# Altium project bms_afe_tester-1_1.PrjPcb (part 2 of 2)

## Sheet pmic_mt3406_buck.SchDoc
size A
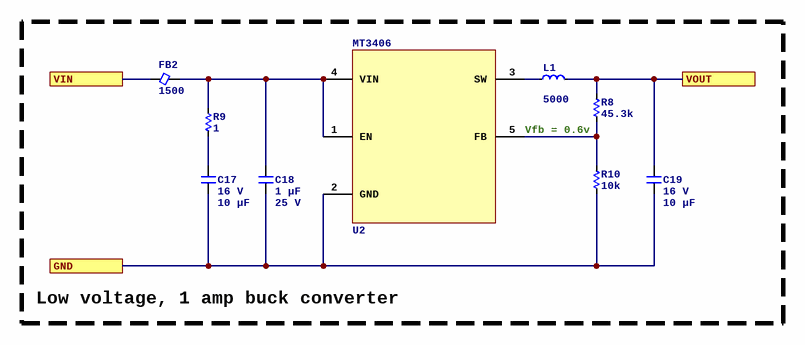
[diagram p10: pmic_mt3406_buck.SchDoc]

### Parts
C17  Voltage Rating: 16 V  Capacitance: 10 µF  [C0805]  (hidden comment: CL21B106KOQNNNE)
C18  Capacitance: 1 µF  Voltage Rating: 25 V  [C0603]  (hidden comment: CL10B105KA8NNNC)
C19  Voltage Rating: 16 V  Capacitance: 10 µF  [C0805]  (hidden comment: CL21B106KOQNNNE)
FB2  Current Rating (mA): 1500  [FB0805]  (hidden comment: MPZ2012S102AT000)
L1  Current Rating (mA): 5000  [SMD-4.1x4.1x2.0]  (hidden comment: FTC404020S4R7MGCA)
R8  value 45.3k  [R0402]  (hidden comment: FRC0402F4532TS)
R9  value 1  [R0402]  (hidden comment: CRCW04021R00FKEDC)
R10  value 10k  [R0402]  (hidden comment: 0402WGF1002TCE)
U2  MT3406  [5SOT23]

### Ports
GND, VIN, VOUT

### Nets
3P3: C19.1 L1.2 R8.1 ; port VOUT
GND: C17.2 C18.2 C19.2 R10.2 U2.2(GND) ; port GND
NetC17_1: C17.1 R9.1
NetC18_1: C18.1 FB2.2 R9.2 U2.1(EN) U2.4(VIN)
NetD2_2: FB2.1 ; port VIN
NetL1_1: L1.1 U2.3(SW)
NetR8_2: R8.2 R10.1 U2.5(FB)

### Notes on the sheet
- Vfb = 0.6v
- Low voltage, 1 amp buck converter

### Library data of the parts
C17 C19 = CL21B106KOQNNNE: Manufacturer: Samsung Electro-Mechanics; Dielectric: X7R; Manufacturer Part Number: CL21B106KOQNNNE; Package: 0805; Supplier 2: LCSC; Supplier Part Number 2: C95841; ComponentLink1Description: Datasheet; ComponentLink1URL: https://wmsc.lcsc.com/wmsc/upload/file/pdf/v2/lcsc/2304140030_Samsung-Electro-Mechanics-CL21B106KOQNNNE_C95841.pdf
C18 = CL10B105KA8NNNC: Manufacturer: Samsung Electro-Mechanics; Dielectric: X7R; ComponentLink1URL: https://wmsc.lcsc.com/wmsc/upload/file/pdf/v2/lcsc/2304140030_Samsung-Electro-Mechanics-CL10B105KA8NNNC_C29936.pdf; ComponentLink1Description: Datasheet; Manufacturer Part Number: CL10B105KA8NNNC; Package: 0603; Supplier 2: LCSC; Supplier Part Number 2: C29936
FB2 = MPZ2012S102AT000: Manufacturer: TDK; Z @ 100 MHz: 1000; DCR (mOhms): 150; Manufacturer Part Number: MPZ2012S102AT000; Package: 0805; Supplier 2: LCSC; Supplier Part Number 2: C76817; ComponentLink1Description: Datasheet; ComponentLink1URL: https://wmsc.lcsc.com/wmsc/upload/file/pdf/v2/lcsc/2304140030_TDK-MPZ2012S102AT000_C76817.pdf
L1 = FTC404020S4R7MGCA: 4.7 µH SMD power inductor; Manufacturer: cjiang; DCR (mOhms): 58; Inductance (µH): 4.7; Manufacturer Part Number: FTC404020S4R7MGCA; ComponentLink1Description: Datasheet; ComponentLink1URL: https://www.lcsc.com/datasheet/C39676072.pdf; Supplier 2: LCSC; Supplier Part Number 2: C39676072
R8 = FRC0402F4532TS: Manufacturer: FOJAN; Tolerance: 1%; Temperature Coefficient: ±100ppm/?; Power Rating (mW): 62.5; ComponentLink1Description: Datasheet; ComponentLink1URL: https://datasheet.lcsc.com/lcsc/2308241947_FOJAN-FRC0402F4532TS_C2933099.pdf; Manufacturer Part Number: FRC0402F4532TS; Package: 0402; Supplier 2: LCSC; Supplier Part Number 2: C2933099
R9 = CRCW04021R00FKEDC: Manufacturer: Vishay Intertech; Tolerance: 1%; Temperature Coefficient: ±100ppm/?; Power Rating (mW): 62.5; ComponentLink1Description: Datasheet; ComponentLink1URL: https://datasheet.lcsc.com/lcsc/2304140030_Vishay-Intertech-CRCW04021R00FKEDC_C2077765.pdf; Manufacturer Part Number: CRCW04021R00FKEDC; Package: 0402; Supplier 2: LCSC; Supplier Part Number 2: C2077765
R10 = 0402WGF1002TCE: Manufacturer: UNI-ROYAL(Uniroyal Elec); Tolerance: 1%; Temperature Coefficient: ±100ppm/?; Power Rating (mW): 62.5; ComponentLink1Description: Datasheet; ComponentLink1URL: https://wmsc.lcsc.com/wmsc/upload/file/pdf/v2/lcsc/2206010100_UNI-ROYAL-Uniroyal-Elec-0402WGF1002TCE_C25744.pdf; Manufacturer Part Number: 0402WGF1002TCE; Package: 0402; Supplier 2: LCSC; Supplier Part Number 2: C25744
U2 = MT3406: 1 A synchronous buck converter, 2–6 V input, 1.5 MHz, 0.6 V minimum output, 10 µA typical quiescent current, SOT-23-5; Manufacturer: XI'AN Aerosemi Tech; Supplier 2: LCSC; Supplier Part Number 2: C22462728; Manufacturer Part Number: MT3406; ComponentLink1Description: Datasheet; ComponentLink1URL: https://www.lcsc.com/datasheet/C22462728.pdf

## Sheet cell_simulator.SchDoc
size C
Used 16 times, as channels cell0, cell1, cell2, cell3, cell4, cell5, cell6, cell7, cell8, cell9, cell10, cell11, cell12, cell13, cell14, cell15. Parts and nets are listed once, with the designators drawn on the sheet.
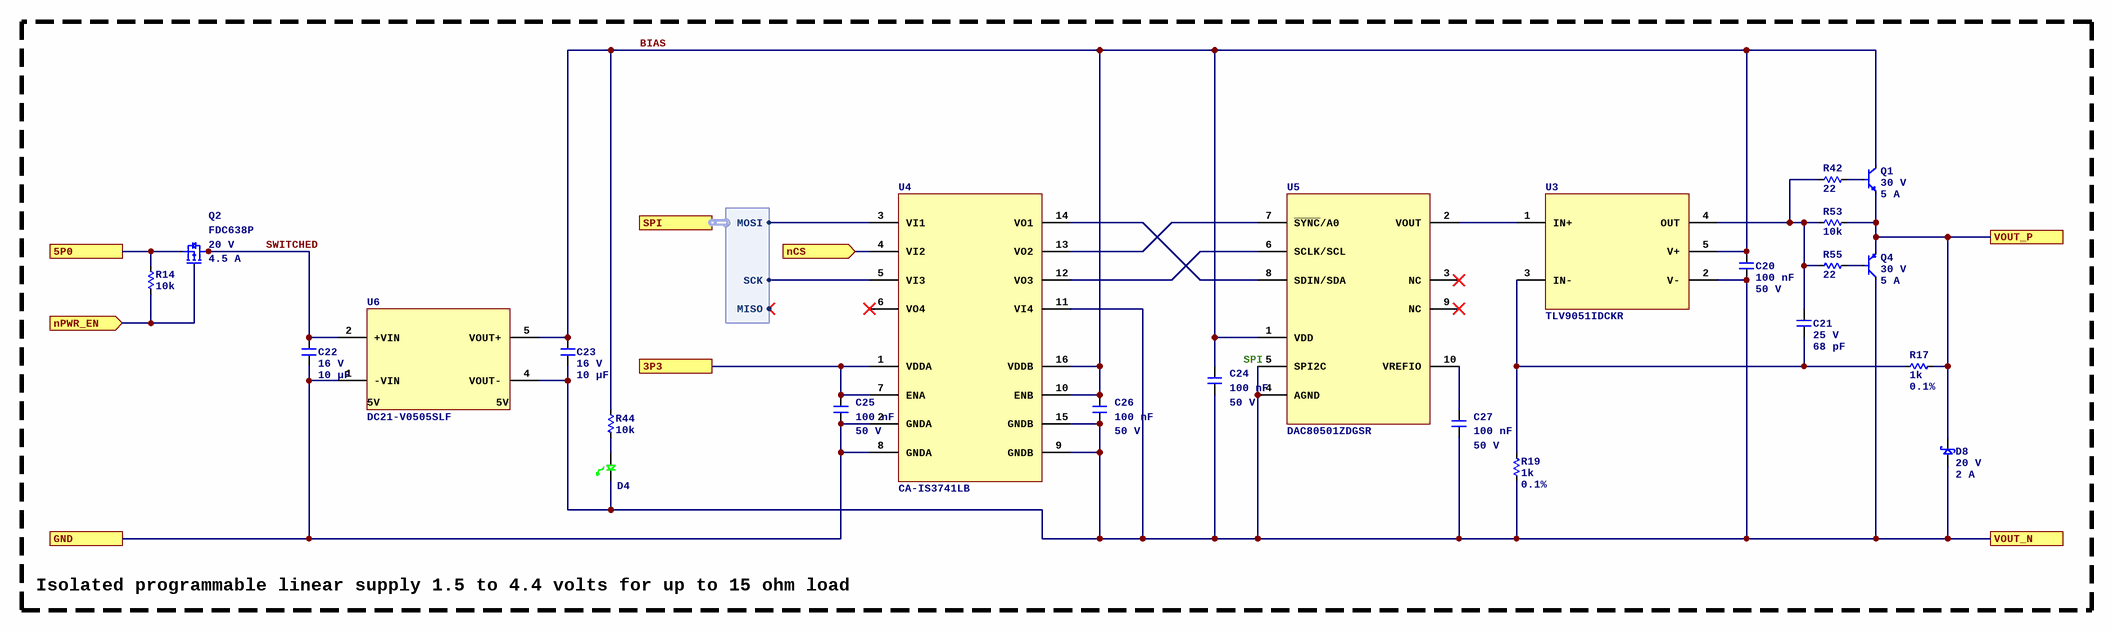
[diagram p11: cell_simulator.SchDoc]

### Parts
C20  Capacitance: 100 nF  Voltage Rating: 50 V  [C0402]  (hidden comment: CL05B104KB54PNC)
C21  Voltage Rating: 25 V  Capacitance: 68 pF  [C0402]  (hidden comment: CBR04C680F3GAC)
C22  Voltage Rating: 16 V  Capacitance: 10 µF  [C0805]  (hidden comment: CL21B106KOQNNNE)
C23  Voltage Rating: 16 V  Capacitance: 10 µF  [C0805]  (hidden comment: CL21B106KOQNNNE)
C24  Capacitance: 100 nF  Voltage Rating: 50 V  [C0402]  (hidden comment: CL05B104KB54PNC)
C25  Capacitance: 100 nF  Voltage Rating: 50 V  [C0402]  (hidden comment: CL05B104KB54PNC)
C26  Capacitance: 100 nF  Voltage Rating: 50 V  [C0402]  (hidden comment: CL05B104KB54PNC)
C27  Capacitance: 100 nF  Voltage Rating: 50 V  [C0402]  (hidden comment: CL05B104KB54PNC)
D4  LTST-C190GKT  [LED_0603P_GREEN]  (value not drawn)
D8  Vr: 20 V  Current: 2 A  [ESMP]  (hidden comment: MSS2P2-M3/89A)
Q1  Voltage: 30 V  Current: 5 A  [TO-252-3]  (hidden comment: 2SCR572D3TL1)
Q2  FDC638P  Voltage: 20 V  Current: 4.5 A  [6SOT23]
Q4  Voltage: 30 V  Current: 5 A  [TO-252-3]  (hidden comment: 2SAR572D3TL1)
R14  value 10k  [R0402]  (hidden comment: 0402WGF1002TCE)
R17  value 1k  Tolerance: 0.1%  [R0402]  (hidden comment: ERA2AEB102X)
R19  value 1k  Tolerance: 0.1%  [R0402]  (hidden comment: ERA2AEB102X)
R42  value 22  [R0402]  (hidden comment: 0402WGF220JTCE)
R44  value 10k  [R0402]  (hidden comment: 0402WGF1002TCE)
R53  value 10k  [R0402]  (hidden comment: 0402WGF1002TCE)
R55  value 22  [R0402]  (hidden comment: 0402WGF220JTCE)
U3  TLV9051IDCKR  [5SC70]
U4  CA-IS3741LB  [16SSOP635]
U5  DAC80501ZDGSR  [TI_DGS]
U6  DC21-V0505SLF  [HALO_DC21]

### Blocks framed on the sheet
SPI: C20-C27 D4 D8 Q1 Q2 Q4 R14 R17 R19 R42 R44 R53 R55 U3-U6

### Ports
3P3, 5P0, GND, nCS (in), nPWR_EN (in), SPI (harness SPI), VOUT_N, VOUT_P

### Harnesses
SPI: MISO, SCK, MOSI

### Nets
3P3: C25.1 U4.1(VDDA) U4.7(ENA) ; port 3P3
5P0: Q2.4 R14.2 ; port 5P0
BIAS: C20.1 C23.1 C24.1 C26.1 Q1.4(C) R44.2 U3.5(V+) U4.10(ENB) U4.16(VDDB) U5.1(VDD) U6.5(VOUT+)
GND: C22.2 C25.2 U4.2(GNDA) U4.8(GNDA) U6.1(-VIN) ; port GND
nCS: U4.4(VI2) ; port nCS
nPWR_EN: Q2.3 R14.1 ; port nPWR_EN
SWITCHED: C22.1 Q2.1 Q2.2 Q2.5 Q2.6 U6.2(+VIN)
VOUT_N: C20.2 C23.2 C24.2 C26.2 C27.2 D4.2 D8.1 Q4.4(C) R19.1 U3.2(V-) U4.9(GNDB) U4.11(VI4) U4.15(GNDB) U5.4(AGND) U5.5(SPI2C) U6.4(VOUT-) ; port VOUT_N
VOUT_P: D8.2 Q1.3(E) Q4.3(E) R17.1 R53.1 ; port VOUT_P
NetC21_1: C21.1 R42.2 R53.2 R55.2 U3.4(OUT)
NetC21_2: C21.2 R17.2 R19.2 U3.3(IN-)
NetC27_1: C27.1 U5.10(VREFIO)
NetD4_1: D4.1 R44.1
NetQ1_1: Q1.1(B) R42.1
NetQ4_1: Q4.1(B) R55.1
NetU3_1: U3.1(IN+) U5.2(VOUT)
NetU4_3: U4.3(VI1) ; port SPI.MOSI
NetU4_5: U4.5(VI3) ; port SPI.SCK
NetU4_12: U4.12(VO3) U5.6(SCLK/SCL)
NetU4_13: U4.13(VO2) U5.7(~{SYNC}/A0)
NetU4_14: U4.14(VO1) U5.8(SDIN/SDA)

Not connected (* = marked no-connect by the designer): U4 6(VO4)*; U5 3(NC)* 9(NC)*

### Channels
cell0: designators end in A; ports 3P3=3P3 5P0=5P0 GND=GND nCS=nCS00 nPWR_EN=PWR_EN00 VOUT_N=C0_N VOUT_P=C0_P
cell1: designators end in B; ports 3P3=3P3 5P0=5P0 GND=GND nCS=nCS01 nPWR_EN=PWR_EN01 VOUT_N=C1_N VOUT_P=C1_P
cell2: designators end in C; ports 3P3=3P3 5P0=5P0 GND=GND nCS=nCS02 nPWR_EN=PWR_EN02 VOUT_N=C2_N VOUT_P=C2_P
cell3: designators end in D; ports 3P3=3P3 5P0=5P0 GND=GND nCS=nCS03 nPWR_EN=PWR_EN03 VOUT_N=C3_N VOUT_P=C3_P
cell4: designators end in E; ports 3P3=3P3 5P0=5P0 GND=GND nCS=nCS04 nPWR_EN=PWR_EN04 VOUT_N=C4_N VOUT_P=C4_P
cell5: designators end in F; ports 3P3=3P3 5P0=5P0 GND=GND nCS=nCS05 nPWR_EN=PWR_EN05 VOUT_N=C5_N VOUT_P=C5_P
cell6: designators end in G; ports 3P3=3P3 5P0=5P0 GND=GND nCS=nCS06 nPWR_EN=PWR_EN06 VOUT_N=C6_N VOUT_P=C6_P
cell7: designators end in H; ports 3P3=3P3 5P0=5P0 GND=GND nCS=nCS07 nPWR_EN=PWR_EN07 VOUT_N=C7_N VOUT_P=C7_P
cell8: designators end in I; ports 3P3=3P3 5P0=5P0 GND=GND nCS=nCS08 nPWR_EN=PWR_EN08 VOUT_N=C8_N VOUT_P=C8_P
cell9: designators end in J; ports 3P3=3P3 5P0=5P0 GND=GND nCS=nCS09 nPWR_EN=PWR_EN09 VOUT_N=C9_N VOUT_P=C9_P
cell10: designators end in K; ports 3P3=3P3 5P0=5P0 GND=GND nCS=nCS10 nPWR_EN=PWR_EN10 VOUT_N=C10_N VOUT_P=C10_P
cell11: designators end in L; ports 3P3=3P3 5P0=5P0 GND=GND nCS=nCS11 nPWR_EN=PWR_EN11 VOUT_N=C11_N VOUT_P=C11_P
cell12: designators end in M; ports 3P3=3P3 5P0=5P0 GND=GND nCS=nCS12 nPWR_EN=PWR_EN12 VOUT_N=C12_N VOUT_P=C12_P
cell13: designators end in N; ports 3P3=3P3 5P0=5P0 GND=GND nCS=nCS13 nPWR_EN=PWR_EN13 VOUT_N=C13_N VOUT_P=C13_P
cell14: designators end in O; ports 3P3=3P3 5P0=5P0 GND=GND nCS=nCS14 nPWR_EN=PWR_EN14 VOUT_N=C14_N VOUT_P=C14_P
cell15: designators end in P; ports 3P3=3P3 5P0=5P0 GND=GND nCS=nCS15 nPWR_EN=PWR_EN15 VOUT_N=C15_N VOUT_P=C15_P

### Notes on the sheet
- Isolated programmable linear supply 1.5 to 4.4 volts for up to 15 ohm load
- (in symbol DC21-V0505SLF) 5V

### Library data of the parts
C20 C24-C27 = CL05B104KB54PNC: Manufacturer: Samsung Electro-Mechanics; Dielectric: X7R; ComponentLink1URL: https://wmsc.lcsc.com/wmsc/upload/file/pdf/v2/lcsc/2304140030_Samsung-Electro-Mechanics-CL05B104KB54PNC_C307331.pdf; ComponentLink1Description: Datasheet; Manufacturer Part Number: CL05B104KB54PNC; Package: 0402; Supplier 2: LCSC; Supplier Part Number 2: C307331
C21 = CBR04C680F3GAC: Manufacturer: KEMET; Dielectric: C0G; Manufacturer Part Number: CBR04C680F3GAC; Package: 0402; Supplier 2: LCSC; Supplier Part Number 2: C3831342; ComponentLink1Description: Datasheet; ComponentLink1URL: https://wmsc.lcsc.com/wmsc/upload/file/pdf/v2/lcsc/2401181509_KEMET-CBR04C680F3GAC_C3831342.pdf
C22 C23 = CL21B106KOQNNNE: as C17 on sheet pmic_mt3406_buck; Manufacturer Part Number: CL21B106KOQNNNE; Package: 0805; Supplier 2: LCSC; Supplier Part Number 2: C95841; ComponentLink1Description: Datasheet; ComponentLink1URL: https://wmsc.lcsc.com/wmsc/upload/file/pdf/v2/lcsc/2304140030_Samsung-Electro-Mechanics-CL21B106KOQNNNE_C95841.pdf
D4 = LTST-C190GKT: LED GREEN CLEAR 0603 SMD; Manufacturer: Lite-On Inc; Vf: 2.0 V; If: 20 mA; Supplier 1: DigiKey; Manufacturer Part Number: LTST-C190GKT; ComponentLink1URL: https://static.chipdip.ru/lib/459/DOC011459654.pdf; ComponentLink1Description: Datasheet; Supplier Part Number 1: 160-1183-1-ND; Supplier 2: LCSC; Supplier Part Number 2: C125093; LED Color: Green; Supplier 3: Mouser; Supplier Part Number 3: 859-LTST-C190GKT
D8 = MSS2P2-M3/89A: DIODE SCHOTTKY 20V 2A MICROSMP; Manufacturer: Vishay Semiconductor Diodes Division; Supplier 1: DigiKey; ComponentLink1URL: http://www.vishay.com/docs/89054/mss2p3.pdf; Supplier Part Number 1: MSS2P2-M3/89AGICT-ND; Manufacturer Part Number: MSS2P2-M3/89A; ComponentLink1Description: Datasheet; Supplier 2: LCSC; Supplier Part Number 2: C2978531; Diode Type: Schottky; Supplier 3: Mouser; Supplier Part Number 3: 625-MSS2P2-M3
Q1 = 2SCR572D3TL1: NPN power transistor, 30 V, 5 A, low VCE(sat), TO-252-3; Manufacturer: ROHM Semiconductor; Manufacturer Part Number: 2SCR572D3TL1; Polarity: NPN; Supplier 1: DigiKey; Supplier Part Number 1: 2SCR572D3TL1CT-ND; Supplier 2: LCSC; Supplier Part Number 2: C3018572; Supplier 3: Mouser; Supplier Part Number 3: 755-2SCR572D3TL1; ComponentLink1Description: Datasheet; ComponentLink1URL: https://fscdn.rohm.com/en/products/databook/datasheet/discrete/transistor/bipolar/2scr572d3tl1-e.pdf
Q2 = FDC638P: MOSFET P-CH 20V 4.5A SSOT-6; Manufacturer: onsemi; Channel Type: P-channel; Supplier 1: DigiKey; ComponentLink1URL: https://www.onsemi.com/pdf/datasheet/fdc638p-d.pdf; ComponentLink1Description: Datasheet; Supplier Part Number 1: FDC638PCT-ND; Manufacturer Part Number: FDC638P; Supplier 2: LCSC; Supplier Part Number 2: C241772; Supplier 3: Mouser; Supplier Part Number 3: 512-FDC638P
Q4 = 2SAR572D3TL1: PNP power transistor, 30 V, 5 A, low VCE(sat), TO-252-3; Manufacturer: ROHM Semiconductor; Manufacturer Part Number: 2SAR572D3TL1; Polarity: PNP; Supplier 1: DigiKey; Supplier Part Number 1: 2SAR572D3TL1CT-ND; Supplier 2: LCSC; Supplier Part Number 2: C5336541; Supplier 3: Mouser; Supplier Part Number 3: 755-2SAR572D3TL1; ComponentLink1Description: Datasheet; ComponentLink1URL: https://fscdn.rohm.com/en/products/databook/datasheet/discrete/transistor/bipolar/2sar572d3tl1-e.pdf
R14 R44 = 0402WGF1002TCE: as R10 on sheet pmic_mt3406_buck; ComponentLink1Description: Datasheet; ComponentLink1URL: https://wmsc.lcsc.com/wmsc/upload/file/pdf/v2/lcsc/2206010100_UNI-ROYAL-Uniroyal-Elec-0402WGF1002TCE_C25744.pdf; Manufacturer Part Number: 0402WGF1002TCE; Package: 0402; Supplier 2: LCSC; Supplier Part Number 2: C25744
R17 R19 = ERA2AEB102X: Manufacturer: PANASONIC; Power Rating (mW): 63; Temperature Coefficient: ±25ppm/?; Manufacturer Part Number: ERA2AEB102X; Package: 0402; Supplier 2: LCSC; Supplier Part Number 2: C445596; ComponentLink1Description: Datasheet; ComponentLink1URL: https://wmsc.lcsc.com/wmsc/upload/file/pdf/v2/lcsc/2404151006_PANASONIC-ERA2AEB102X_C445596.pdf
R42 R55 = 0402WGF220JTCE: Manufacturer: UNI-ROYAL(Uniroyal Elec); Power Rating (mW): 62.5; Tolerance: 1%; Temperature Coefficient: ±100ppm/?; Manufacturer Part Number: 0402WGF220JTCE; Package: 0402; Supplier 2: LCSC; Supplier Part Number 2: C25092; ComponentLink1Description: Datasheet; ComponentLink1URL: https://wmsc.lcsc.com/wmsc/upload/file/pdf/v2/lcsc/2205311900_UNI-ROYAL-Uniroyal-Elec-0402WGF220JTCE_C25092.pdf
R53 = 0402WGF1002TCE: Manufacturer: UNI-ROYAL(Uniroyal Elec); Power Rating (mW): 62.5; Tolerance: 1%; Temperature Coefficient: ±100ppm/?; Manufacturer Part Number: 0402WGF1002TCE; Package: 0402; Supplier 2: LCSC; Supplier Part Number 2: C25744; ComponentLink1Description: Datasheet; ComponentLink1URL: https://wmsc.lcsc.com/wmsc/upload/file/pdf/v2/lcsc/2206010100_UNI-ROYAL-Uniroyal-Elec-0402WGF1002TCE_C25744.pdf
U3 = TLV9051IDCKR: Single 5 MHz rail-to-rail input/output operational amplifier, 15 V/µs slew rate, SC70-5; Manufacturer: Texas Instruments; Supplier 1: DigiKey; Supplier Part Number 1: 296-TLV9051IDCKRCT-ND; Manufacturer Part Number: TLV9051IDCKR; Supplier Part Number 2: C2873238; ComponentLink1Description: Datasheet; ComponentLink1URL: https://www.ti.com/lit/ds/symlink/tlv9051.pdf; Supplier 2: LCSC; Supplier 3: Mouser; Supplier Part Number 3: 595-TLV9051IDCKR
U4 = CA-IS3741LB: 150Mbps 150kV/µs 2.5V~5.5V 2.5V~5.5V 3 3750 Low Level SSOP-16-150mil Digital Isolators ROHS; Manufacturer: Chipanalog; Manufacturer Part Number: CA-IS3741LB; Supplier 2: LCSC; Supplier Part Number 2: C3202820; ComponentLink1Description: Datasheet; ComponentLink1URL: https://e.chipanalog.com/Public/Uploads/uploadfile/files/20250123/CAIS374xdatasheetVersion1.08en20241217.pdf
U5 = DAC80501ZDGSR: 16 Bit Digital to Analog Converter 1 10-VSSOP, zero output at startup; Manufacturer: Texas Instruments; Manufacturer Part Number: DAC80501ZDGSR; Supplier 1: DigiKey; ComponentLink1Description: Datasheet; ComponentLink1URL: https://www.ti.com/lit/ds/symlink/dac80501.pdf; Supplier 2: LCSC; Supplier Part Number 2: C1852033; Supplier Part Number 1: 296-DAC80501ZDGSRCT-ND; Supplier 3: Mouser; Supplier Part Number 3: 595-DAC80501ZDGSR
U6 = DC21-V0505SLF: Isolated Module DC DC Converter 1 Output 5V 400mA 4.5V - 5.5V Input; Manufacturer: HALO Electronics, Inc.; Supplier 1: DigiKey; Supplier Part Number 1: 5843-DC21-V0505SLF-ND; Manufacturer Part Number: DC21-V0505SLF; ComponentLink1Description: Datasheet; ComponentLink1URL: https://www.haloelectronics.com/pdf/dc-converter-1w2w.pdf; Supplier 3: Mouser; Supplier Part Number 3: 493-DC21-V0505SLF

## Sheet pmic_tps51386_buck.SchDoc
size A
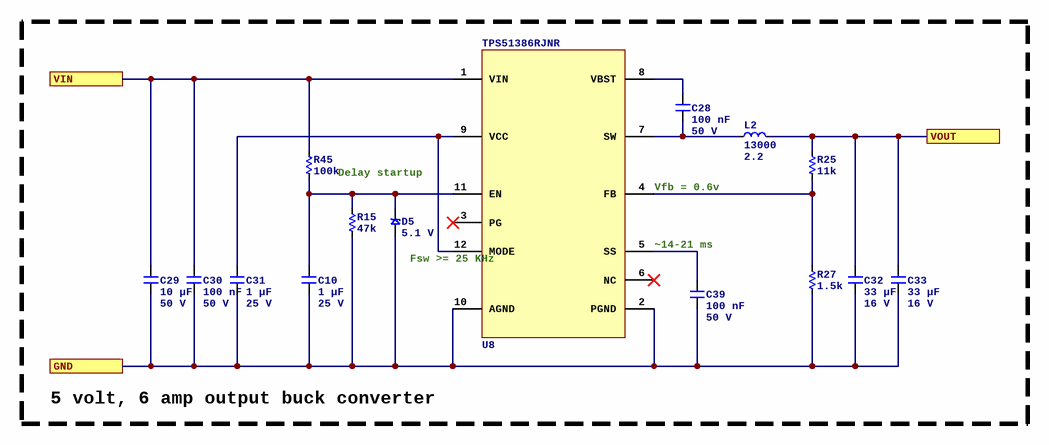
[diagram p12: pmic_tps51386_buck.SchDoc]

### Parts
C10  Capacitance: 1 µF  Voltage Rating: 25 V  [C0603]  (hidden comment: CL10B105KA8NNNC)
C28  Capacitance: 100 nF  Voltage Rating: 50 V  [C0402]  (hidden comment: CL05B104KB54PNC)
C29  Capacitance: 10 µF  Voltage Rating: 50 V  [C1206]  (hidden comment: CL31B106KBHNNNE)
C30  Capacitance: 100 nF  Voltage Rating: 50 V  [C0402]  (hidden comment: CL05B104KB54PNC)
C31  Capacitance: 1 µF  Voltage Rating: 25 V  [C0603]  (hidden comment: CL10B105KA8NNNC)
C32  Capacitance: 33 µF  Voltage Rating: 16 V  [C1812]  (hidden comment: C4532X7R1C336MT000N)
C33  Capacitance: 33 µF  Voltage Rating: 16 V  [C1812]  (hidden comment: C4532X7R1C336MT000N)
C39  Capacitance: 100 nF  Voltage Rating: 50 V  [C0402]  (hidden comment: CL05B104KB54PNC)
D5  Vr: 5.1 V  [SOD323]  (hidden comment: SZMM3Z5V1ST1G)
L2  Current Rating (mA): 13000  Inductance (µH): 2.2  [BOURNS_SRP7030CA]  (hidden comment: SRP7030CA-2R2M)
R15  value 47k  [R0402]  (hidden comment: 0402WGF4702TCE)
R25  value 11k  [R0402]  (hidden comment: 0402WGF1102TCE)
R27  value 1.5k  [R0402]  (hidden comment: 0402WGF1501TCE)
R45  value 100k  [R0402]  (hidden comment: 0402WGF1003TCE)
U8  TPS51386RJNR  [TI_RJN]

### Ports
GND, VIN, VOUT

### Nets
5P0: C32.1 C33.1 L2.2 R25.2 ; port VOUT
GND: C10.2 C29.2 C30.2 C31.2 C32.2 C33.2 C39.2 D5.1 R15.2 R27.2 U8.2(PGND) U8.10(AGND) ; port GND
VBUS: C29.1 C30.1 R45.1 U8.1(VIN) ; port VIN
NetC10_1: C10.1 D5.2 R15.1 R45.2 U8.11(EN)
NetC28_1: C28.1 U8.8(VBST)
NetC28_2: C28.2 L2.1 U8.7(SW)
NetC31_1: C31.1 U8.9(VCC) U8.12(MODE)
NetC39_1: C39.1 U8.5(SS)
NetR25_1: R25.1 R27.1 U8.4(FB)

Not connected (* = marked no-connect by the designer): U8 3(PG)* 6(NC)*

### Notes on the sheet
- Delay startup
- (near U8) Vfb = 0.6v
- (near U8) Fsw >= 25 KHz
- ~14-21 ms
- 5 volt, 6 amp output buck converter

### Library data of the parts
C10 C31 = CL10B105KA8NNNC: as C18 on sheet pmic_mt3406_buck; ComponentLink1URL: https://wmsc.lcsc.com/wmsc/upload/file/pdf/v2/lcsc/2304140030_Samsung-Electro-Mechanics-CL10B105KA8NNNC_C29936.pdf; ComponentLink1Description: Datasheet; Manufacturer Part Number: CL10B105KA8NNNC; Package: 0603; Supplier 2: LCSC; Supplier Part Number 2: C29936
C28 C30 C39 = CL05B104KB54PNC: as C20 on sheet cell_simulator; ComponentLink1URL: https://wmsc.lcsc.com/wmsc/upload/file/pdf/v2/lcsc/2304140030_Samsung-Electro-Mechanics-CL05B104KB54PNC_C307331.pdf; ComponentLink1Description: Datasheet; Manufacturer Part Number: CL05B104KB54PNC; Package: 0402; Supplier 2: LCSC; Supplier Part Number 2: C307331
C29 = CL31B106KBHNNNE: Manufacturer: Samsung Electro-Mechanics; Dielectric: X7R; ComponentLink1URL: https://wmsc.lcsc.com/wmsc/upload/file/pdf/v2/lcsc/1810221111_Samsung-Electro-Mechanics-CL31B106KBHNNNE_C89632.pdf; ComponentLink1Description: Datasheet; Manufacturer Part Number: CL31B106KBHNNNE; Package: 1206; Supplier 2: LCSC; Supplier Part Number 2: C89632
C32 C33 = C4532X7R1C336MT000N: Manufacturer: TDK; Dielectric: X7R; ComponentLink1URL: https://wmsc.lcsc.com/wmsc/upload/file/pdf/v2/lcsc/2304140030_TDK-C4532X7R1C336MT000N_C342604.pdf; ComponentLink1Description: Datasheet; Manufacturer Part Number: C4532X7R1C336MT000N; Package: 1812; Supplier 2: LCSC; Supplier Part Number 2: C342604
D5 = SZMM3Z5V1ST1G: Zener Diode 5.1 V 300 mW ±2% Surface Mount SOD-323; Manufacturer: onsemi; Current: 58.8 mA; Supplier 1: DigiKey; Manufacturer Part Number: SZMM3Z5V1ST1G; ComponentLink1URL: https://www.onsemi.com/pdf/datasheet/mm3z2v4st1-d.pdf; ComponentLink1Description: Datasheet; Supplier Part Number 1: SZMM3Z5V1ST1GOSCT-ND; Supplier 2: LCSC; Supplier Part Number 2: C152524; Diode Type: Zener; Supplier 3: Mouser; Supplier Part Number 3: 863-SZMM3Z5V1ST1G
L2 = SRP7030CA-2R2M: 2.2 µH shielded power inductor; Manufacturer: BOURNS; DCR (mOhms): 13.7; Manufacturer Part Number: SRP7030CA-2R2M; ComponentLink1Description: Datasheet; ComponentLink1URL: https://www.bourns.com/docs/product-datasheets/SRP7030CA.pdf; Supplier 2: LCSC; Supplier Part Number 2: C1332137; Supplier 1: DigiKey; Supplier Part Number 1: SRP7030CA-2R2MCT-ND; Supplier 3: Mouser; Supplier Part Number 3: 652-SRP7030CA-2R2M
R15 = 0402WGF4702TCE: Manufacturer: UNI-ROYAL(Uniroyal Elec); Tolerance: 1%; Temperature Coefficient: ±100ppm/?; Power Rating (mW): 62.5; ComponentLink1Description: Datasheet; ComponentLink1URL: https://wmsc.lcsc.com/wmsc/upload/file/pdf/v2/lcsc/2206010100_UNI-ROYAL-Uniroyal-Elec-0402WGF4702TCE_C25792.pdf; Manufacturer Part Number: 0402WGF4702TCE; Package: 0402; Supplier 2: LCSC; Supplier Part Number 2: C25792
R25 = 0402WGF1102TCE: Manufacturer: UNI-ROYAL(Uniroyal Elec); Power Rating (mW): 62.5; Tolerance: 1%; Temperature Coefficient: ±100ppm/?; Manufacturer Part Number: 0402WGF1102TCE; Package: 0402; Supplier 2: LCSC; Supplier Part Number 2: C25749; ComponentLink1Description: Datasheet; ComponentLink1URL: https://wmsc.lcsc.com/wmsc/upload/file/pdf/v2/lcsc/2206010100_UNI-ROYAL-Uniroyal-Elec-0402WGF1102TCE_C25749.pdf
R27 = 0402WGF1501TCE: Manufacturer: UNI-ROYAL(Uniroyal Elec); Tolerance: 1%; Temperature Coefficient: ±100ppm/?; Power Rating (mW): 62.5; ComponentLink1Description: Datasheet; ComponentLink1URL: https://wmsc.lcsc.com/wmsc/upload/file/pdf/v2/lcsc/2206010045_UNI-ROYAL-Uniroyal-Elec-0402WGF1501TCE_C25867.pdf; Manufacturer Part Number: 0402WGF1501TCE; Package: 0402; Supplier 2: LCSC; Supplier Part Number 2: C25867
R45 = 0402WGF1003TCE: Manufacturer: UNI-ROYAL(Uniroyal Elec); Tolerance: 1%; Temperature Coefficient: ±100ppm/?; Power Rating (mW): 62.5; ComponentLink1Description: Datasheet; ComponentLink1URL: https://wmsc.lcsc.com/wmsc/upload/file/pdf/v2/lcsc/2206010100_UNI-ROYAL-Uniroyal-Elec-0402WGF1003TCE_C25741.pdf; Manufacturer Part Number: 0402WGF1003TCE; Package: 0402; Supplier 2: LCSC; Supplier Part Number 2: C25741
U8 = TPS51386RJNR: Buck Switching Regulator IC Positive Adjustable 0.6V 1 Output 8A 12-PowerVFQFN; Manufacturer: Texas Instruments; Supplier 2: LCSC; Supplier Part Number 2: C22388893; Manufacturer Part Number: TPS51386RJNR; Supplier 1: DigiKey; Supplier Part Number 1: 296-TPS51386RJNRCT-ND; Supplier 3: Mouser; Supplier Part Number 3: 595-TPS51386RJNR; ComponentLink1Description: Datasheet; ComponentLink1URL: https://www.ti.com/lit/ds/symlink/tps51386.pdf

## Sheet gpio_pcal9535a_expander.SchDoc
size A
Used 2 times, as channels expander0, expander1. Parts and nets are listed once, with the designators drawn on the sheet.
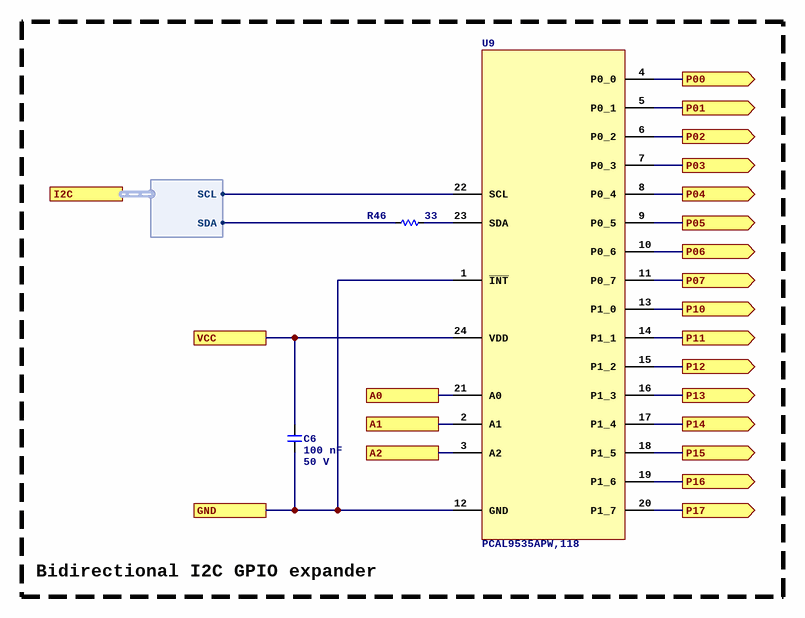
[diagram p13: gpio_pcal9535a_expander.SchDoc]

### Parts
C6  Capacitance: 100 nF  Voltage Rating: 50 V  [C0402]  (hidden comment: CL05B104KB54PNC)
R46  value 33  [R0402]  (hidden comment: CRCW040233R0FKED)
U9  PCAL9535APW,118  [24TSSOP65]

### Blocks framed on the sheet
Bidirectional I2C GPIO expander: C6 R46 U9

### Ports
A0, A1, A2, GND, I2C (harness I2C), P00 (out), P01 (out), P02 (out), P03 (out), P04 (out), P05 (out), P06 (out), P07 (out), P10 (out), P11 (out), P12 (out), P13 (out), P14 (out), P15 (out), P16 (out), P17 (out), VCC

### Harnesses
I2C: SCL, SDA

### Nets
A0: U9.21(A0) ; port A0
A1: U9.2(A1) ; port A1
A2: U9.3(A2) ; port A2
GND: C6.2 U9.1(~{INT}) U9.12(GND) ; port GND
P00: U9.4(P0_0) ; port P00
P01: U9.5(P0_1) ; port P01
P02: U9.6(P0_2) ; port P02
P03: U9.7(P0_3) ; port P03
P04: U9.8(P0_4) ; port P04
P05: U9.9(P0_5) ; port P05
P06: U9.10(P0_6) ; port P06
P07: U9.11(P0_7) ; port P07
P10: U9.13(P1_0) ; port P10
P11: U9.14(P1_1) ; port P11
P12: U9.15(P1_2) ; port P12
P13: U9.16(P1_3) ; port P13
P14: U9.17(P1_4) ; port P14
P15: U9.18(P1_5) ; port P15
P16: U9.19(P1_6) ; port P16
P17: U9.20(P1_7) ; port P17
VCC: C6.1 U9.24(VDD) ; port VCC
NetR46_1: R46.1 U9.23(SDA)
NetR46_2: R46.2 ; port I2C.SDA
NetU9_22: U9.22(SCL) ; port I2C.SCL

### Channels
expander0: designators end in A; ports A0=GND A1=GND A2=GND GND=GND P00=PWR_EN00 P01=nCS00 P02=PWR_EN01 P03=nCS01 P04=PWR_EN02 P05=nCS02 P06=nCS03 P07=PWR_EN03 P10=nCS04 P11=PWR_EN04 P12=nCS05 P13=PWR_EN05 P14=nCS06 P15=PWR_EN06 P16=nCS07 P17=PWR_EN07 VCC=3P3
expander1: designators end in B; ports A0=3P3 A1=GND A2=GND GND=GND P00=PWR_EN08 P01=nCS08 P02=PWR_EN09 P03=nCS09 P04=PWR_EN10 P05=nCS10 P06=PWR_EN11 P07=nCS11 P10=PWR_EN12 P11=nCS12 P12=PWR_EN13 P13=nCS13 P14=PWR_EN14 P15=nCS14 P16=nCS15 P17=PWR_EN15 VCC=3P3

### Library data of the parts
C6 = CL05B104KB54PNC: as C20 on sheet cell_simulator; ComponentLink1URL: https://wmsc.lcsc.com/wmsc/upload/file/pdf/v2/lcsc/2304140030_Samsung-Electro-Mechanics-CL05B104KB54PNC_C307331.pdf; ComponentLink1Description: Datasheet; Manufacturer Part Number: CL05B104KB54PNC; Package: 0402; Supplier 2: LCSC; Supplier Part Number 2: C307331
R46 = CRCW040233R0FKED: Manufacturer: Vishay Intertech; Tolerance: 1%; Temperature Coefficient: ±100ppm/?; Power Rating (mW): 63; ComponentLink1Description: Datasheet; ComponentLink1URL: https://wmsc.lcsc.com/wmsc/upload/file/pdf/v2/lcsc/2304140030_Vishay-Intertech-CRCW040233R0FKED_C242490.pdf; Manufacturer Part Number: CRCW040233R0FKED; Package: 0402; Supplier 2: LCSC; Supplier Part Number 2: C242490
U9 = PCAL9535APW,118: 16-bit I2C/SMBus I/O expander, 400 kHz, with interrupt and Agile I/O, TSSOP-24; Manufacturer: NXP Semiconductors; Manufacturer Part Number: PCAL9535APW,118; Supplier 1: DigiKey; Supplier 2: LCSC; Supplier Part Number 1: 568-9923-1-ND; Supplier Part Number 2: C2669683; Supplier 3: Mouser; Supplier Part Number 3: 771-PCAL9535APW,118; ComponentLink1Description: Datasheet; ComponentLink1URL: https://www.nxp.com/docs/en/data-sheet/PCAL9535A.pdf

## Nets that join several sheets
3P3: top (TP35.1), mcu_stm32h563 (20 pins), eth_lan8742a_phy (C49.1 FB3.1 R83.1 U7.9), pmic_mt3406_buck (C19.1 L1.2 R8.1), cell0 (C25A.1 U4A.1 U4A.7), cell1 (C25B.1 U4B.1 U4B.7), cell2 (C25C.1 U4C.1 U4C.7), cell3 (C25D.1 U4D.1 U4D.7), cell4 (C25E.1 U4E.1 U4E.7), cell5 (C25F.1 U4F.1 U4F.7), cell6 (C25G.1 U4G.1 U4G.7), cell7 (C25H.1 U4H.1 U4H.7), cell8 (C25I.1 U4I.1 U4I.7), cell9 (C25J.1 U4J.1 U4J.7), cell10 (C25K.1 U4K.1 U4K.7), cell11 (C25L.1 U4L.1 U4L.7), cell12 (C25M.1 U4M.1 U4M.7), cell13 (C25N.1 U4N.1 U4N.7), cell14 (C25O.1 U4O.1 U4O.7), cell15 (C25P.1 U4P.1 U4P.7), expander0 (C6A.1 U9A.24), expander1 (C6B.1 U9B.21 U9B.24)
5P0: top (D2.1 TP33.1), cell0 (Q2A.4 R14A.2), cell1 (Q2B.4 R14B.2), cell2 (Q2C.4 R14C.2), cell3 (Q2D.4 R14D.2), cell4 (Q2E.4 R14E.2), cell5 (Q2F.4 R14F.2), cell6 (Q2G.4 R14G.2), cell7 (Q2H.4 R14H.2), cell8 (Q2I.4 R14I.2), cell9 (Q2J.4 R14J.2), cell10 (Q2K.4 R14K.2), cell11 (Q2L.4 R14L.2), cell12 (Q2M.4 R14M.2), cell13 (Q2N.4 R14N.2), cell14 (Q2O.4 R14O.2), cell15 (Q2P.4 R14P.2), pmic_tps51386_buck (C32.1 C33.1 L2.2 R25.2)
GND: top (R51.1 TP39.1 TP43.1), mcu_stm32h563 (26 pins), conn_usbc_power (9 pins), eth_lan8742a_phy (18 pins), conn_usbc_data (9 pins), pmic_mt3406_buck (5 pins), cell0 (5 pins), cell1 (5 pins), cell2 (5 pins), cell3 (5 pins), cell4 (5 pins), cell5 (5 pins), cell6 (5 pins), cell7 (5 pins), cell8 (5 pins), cell9 (5 pins), cell10 (5 pins), cell11 (5 pins), cell12 (5 pins), cell13 (5 pins), cell14 (5 pins), cell15 (5 pins), pmic_tps51386_buck (12 pins), expander0 (6 pins), expander1 (5 pins)
VBUS: mcu_stm32h563 (R5.2), conn_usbc_power (C80B.1 J11B.A4 J11B.B4), pmic_tps51386_buck (C29.1 C30.1 R45.1 U8.1)
C0_N: top (H1.1 TP5.1), cell0 (16 pins)
C0_P: top (H2.1 TP4.1), cell0 (5 pins)
C1_N: top (H3.1 TP7.1), cell1 (16 pins)
C1_P: top (H4.1 TP6.1), cell1 (5 pins)
C2_N: top (H5.1 TP9.1), cell2 (16 pins)
C2_P: top (H6.1 TP8.1), cell2 (5 pins)
C3_N: top (H7.1 TP11.1), cell3 (16 pins)
C3_P: top (H8.1 TP10.1), cell3 (5 pins)
C4_N: top (H9.1 TP13.1), cell4 (16 pins)
C4_P: top (H10.1 TP12.1), cell4 (5 pins)
C5_N: top (H11.1 TP15.1), cell5 (16 pins)
C5_P: top (H12.1 TP14.1), cell5 (5 pins)
C6_N: top (H13.1 TP17.1), cell6 (16 pins)
C6_P: top (H14.1 TP16.1), cell6 (5 pins)
C7_N: top (H15.1 TP19.1), cell7 (16 pins)
C7_P: top (H16.1 TP18.1), cell7 (5 pins)
C8_N: top (H17.1 TP21.1), cell8 (16 pins)
C8_P: top (H18.1 TP20.1), cell8 (5 pins)
C9_N: top (H19.1 TP23.1), cell9 (16 pins)
C9_P: top (H20.1 TP22.1), cell9 (5 pins)
C10_N: top (H21.1 TP25.1), cell10 (16 pins)
C10_P: top (H22.1 TP24.1), cell10 (5 pins)
C11_N: top (H23.1 TP27.1), cell11 (16 pins)
C11_P: top (H24.1 TP26.1), cell11 (5 pins)
C12_N: top (H25.1 TP29.1), cell12 (16 pins)
C12_P: top (H26.1 TP28.1), cell12 (5 pins)
C13_N: top (H27.1 TP31.1), cell13 (16 pins)
C13_P: top (H28.1 TP30.1), cell13 (5 pins)
C14_N: top (H29.1 TP34.1), cell14 (16 pins)
C14_P: top (H30.1 TP32.1), cell14 (5 pins)
C15_N: top (H31.1 TP38.1), cell15 (16 pins)
C15_P: top (H32.1 TP36.1), cell15 (5 pins)
ETH_nRST: mcu_stm32h563 (R3.1), eth_lan8742a_phy (C51.1 R83.2 U7.15)
ETH_REFCLK: mcu_stm32h563 (U1.15), eth_lan8742a_phy (R82.2)
I2C1.SCL: mcu_stm32h563 (R21.1 R36.1 TP62.1), expander0 (U9A.22)
I2C1.SDA: mcu_stm32h563 (R35.1 R54.1 TP63.1), expander0 (R46A.2)
I2C3.SCL: mcu_stm32h563 (R4.1 R49.1 TP1.1), expander1 (U9B.22)
I2C3.SDA: mcu_stm32h563 (R34.1 R37.1 TP2.1), expander1 (R46B.2)
nCS00: cell0 (U4A.4), expander0 (U9A.5)
nCS01: cell1 (U4B.4), expander0 (U9A.7)
nCS02: cell2 (U4C.4), expander0 (U9A.9)
nCS03: cell3 (U4D.4), expander0 (U9A.10)
nCS04: cell4 (U4E.4), expander0 (U9A.13)
nCS05: cell5 (U4F.4), expander0 (U9A.15)
nCS06: cell6 (U4G.4), expander0 (U9A.17)
nCS07: cell7 (U4H.4), expander0 (U9A.19)
nCS08: cell8 (U4I.4), expander1 (U9B.5)
nCS09: cell9 (U4J.4), expander1 (U9B.7)
nCS10: cell10 (U4K.4), expander1 (U9B.9)
nCS11: cell11 (U4L.4), expander1 (U9B.11)
nCS12: cell12 (U4M.4), expander1 (U9B.14)
nCS13: cell13 (U4N.4), expander1 (U9B.16)
nCS14: cell14 (U4O.4), expander1 (U9B.18)
nCS15: cell15 (U4P.4), expander1 (U9B.19)
NetD2_2: top (D2.2 D6.2), pmic_mt3406_buck (FB2.1)
PWR_EN00: cell0 (Q2A.3 R14A.1), expander0 (U9A.4)
PWR_EN01: cell1 (Q2B.3 R14B.1), expander0 (U9A.6)
PWR_EN02: cell2 (Q2C.3 R14C.1), expander0 (U9A.8)
PWR_EN03: cell3 (Q2D.3 R14D.1), expander0 (U9A.11)
PWR_EN04: cell4 (Q2E.3 R14E.1), expander0 (U9A.14)
PWR_EN05: cell5 (Q2F.3 R14F.1), expander0 (U9A.16)
PWR_EN06: cell6 (Q2G.3 R14G.1), expander0 (U9A.18)
PWR_EN07: cell7 (Q2H.3 R14H.1), expander0 (U9A.20)
PWR_EN08: cell8 (Q2I.3 R14I.1), expander1 (U9B.4)
PWR_EN09: cell9 (Q2J.3 R14J.1), expander1 (U9B.6)
PWR_EN10: cell10 (Q2K.3 R14K.1), expander1 (U9B.8)
PWR_EN11: cell11 (Q2L.3 R14L.1), expander1 (U9B.10)
PWR_EN12: cell12 (Q2M.3 R14M.1), expander1 (U9B.13)
PWR_EN13: cell13 (Q2N.3 R14N.1), expander1 (U9B.15)
PWR_EN14: cell14 (Q2O.3 R14O.1), expander1 (U9B.17)
PWR_EN15: cell15 (Q2P.3 R14P.1), expander1 (U9B.20)
RMII.CRS_DV: mcu_stm32h563 (U1.23), eth_lan8742a_phy (R91.2)
RMII.RXD0: mcu_stm32h563 (U1.24), eth_lan8742a_phy (R92.2)
RMII.RXD1: mcu_stm32h563 (U1.25), eth_lan8742a_phy (R93.2)
RMII.TX_EN: mcu_stm32h563 (R38.1), eth_lan8742a_phy (U7.16)
RMII.TXD0: mcu_stm32h563 (R40.1), eth_lan8742a_phy (U7.17)
RMII.TXD1: mcu_stm32h563 (R41.1), eth_lan8742a_phy (U7.18)
SMI.MDC: mcu_stm32h563 (U1.9), eth_lan8742a_phy (U7.13)
SMI.MDIO: mcu_stm32h563 (R52.1 U1.16), eth_lan8742a_phy (R81.2)
SPI2.MOSI: mcu_stm32h563 (R33.1), cell0 (U4A.3), cell1 (U4B.3), cell2 (U4C.3), cell3 (U4D.3), cell4 (U4E.3), cell5 (U4F.3), cell6 (U4G.3), cell7 (U4H.3), cell8 (U4I.3), cell9 (U4J.3), cell10 (U4K.3), cell11 (U4L.3), cell12 (U4M.3), cell13 (U4N.3), cell14 (U4O.3), cell15 (U4P.3)
SPI2.SCK: mcu_stm32h563 (R31.1), cell0 (U4A.5), cell1 (U4B.5), cell2 (U4C.5), cell3 (U4D.5), cell4 (U4E.5), cell5 (U4F.5), cell6 (U4G.5), cell7 (U4H.5), cell8 (U4I.5), cell9 (U4J.5), cell10 (U4K.5), cell11 (U4L.5), cell12 (U4M.5), cell13 (U4N.5), cell14 (U4O.5), cell15 (U4P.5)
UCPD1.CC1: mcu_stm32h563 (U1.34), conn_usbc_power (C35B.1 J11B.A5 R13B.1)
UCPD1.CC2: mcu_stm32h563 (U1.35), conn_usbc_power (C34B.1 J11B.B5 R12B.1)
USB._N: mcu_stm32h563 (U1.44), conn_usbc_data (D17A.2 J11A.A7 J11A.B7)
USB._P: mcu_stm32h563 (U1.45), conn_usbc_data (D17A.1 J11A.A6 J11A.B6)
VBUS_DATA: top (D6.1 R50.2), conn_usbc_data (C80A.1 J11A.A4 J11A.B4)
VBUS_DATA_SENSE: top (R50.1 R51.2), mcu_stm32h563 (U1.28)

## Assembly variants
0: not fitted R12B R13B